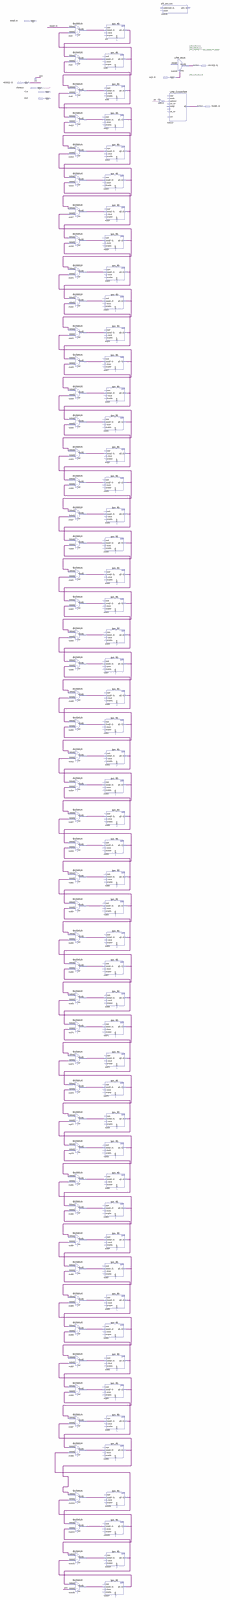
[diagram p0: schematic sheet, whole]
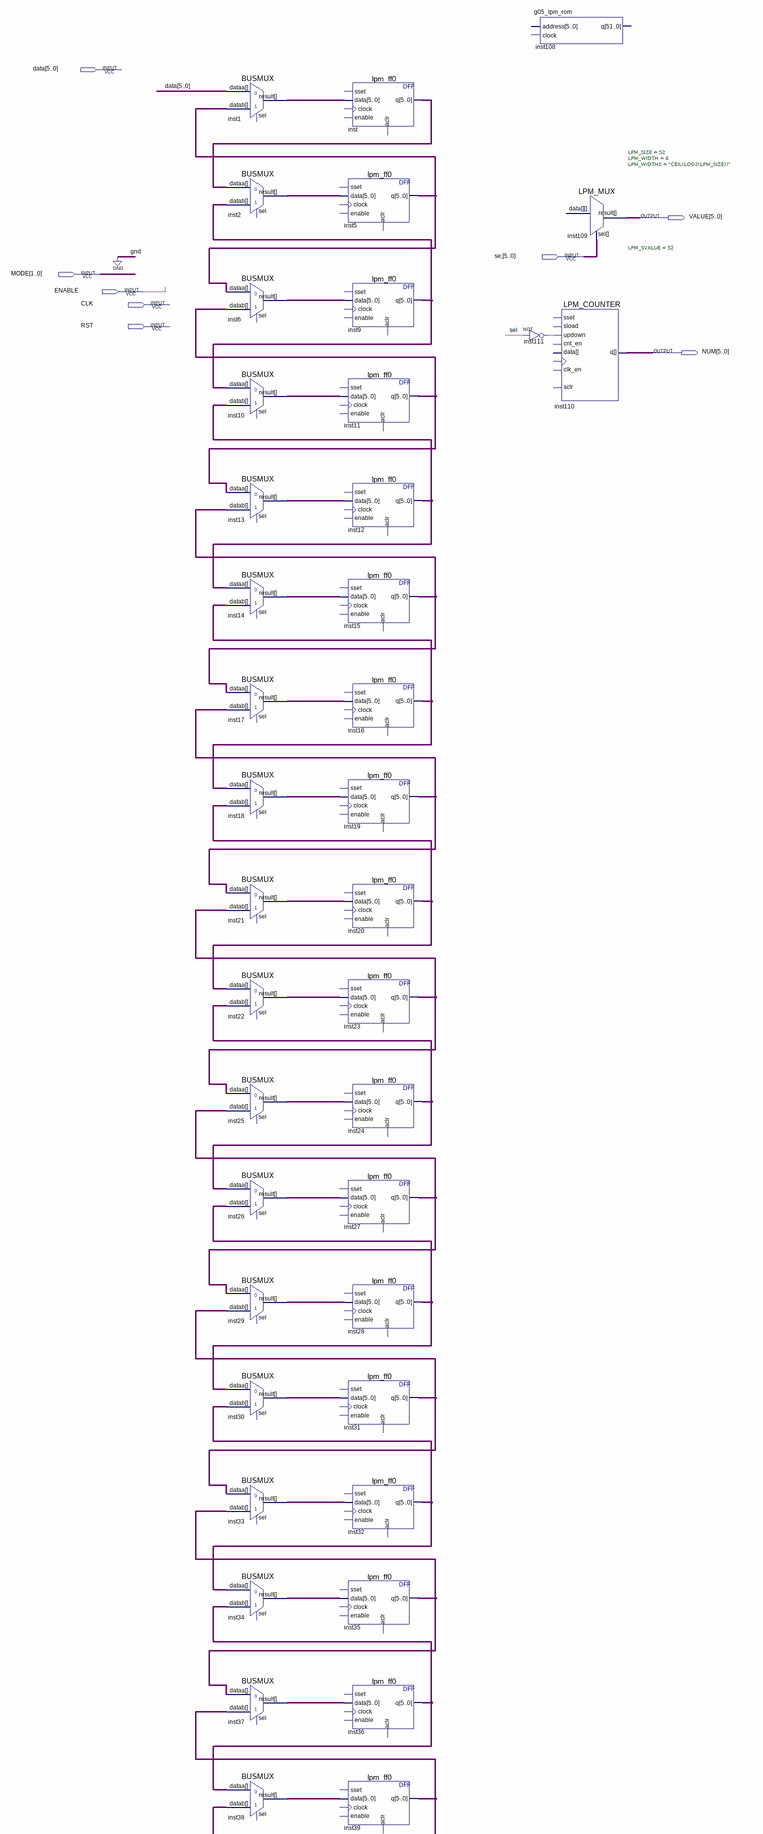
[diagram p1: schematic sheet, upper part]
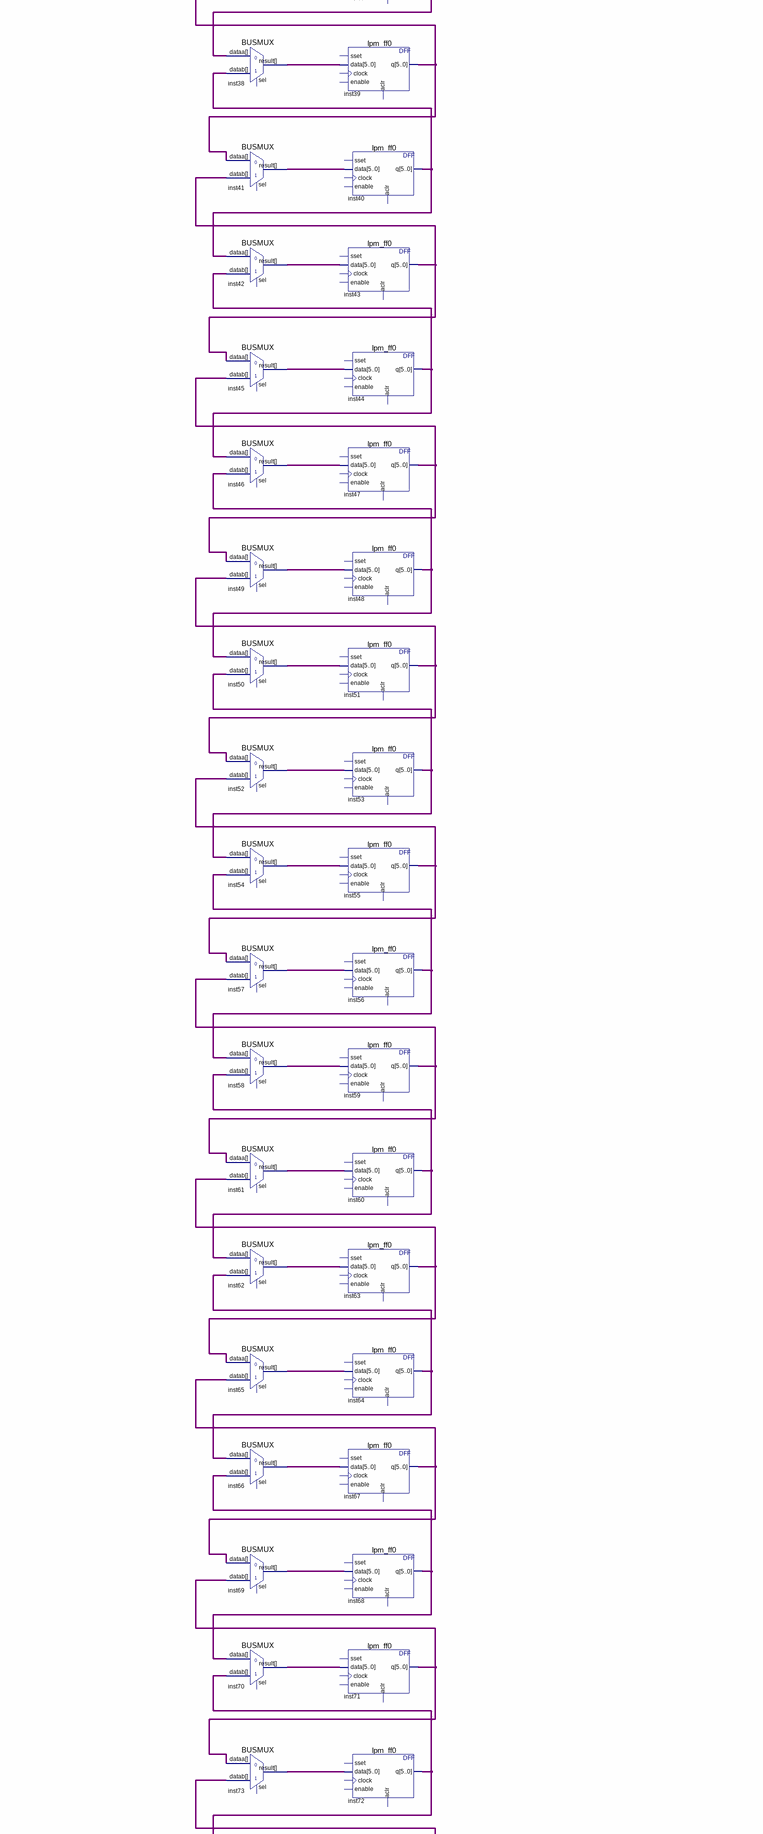
[diagram p2: schematic sheet, middle part]
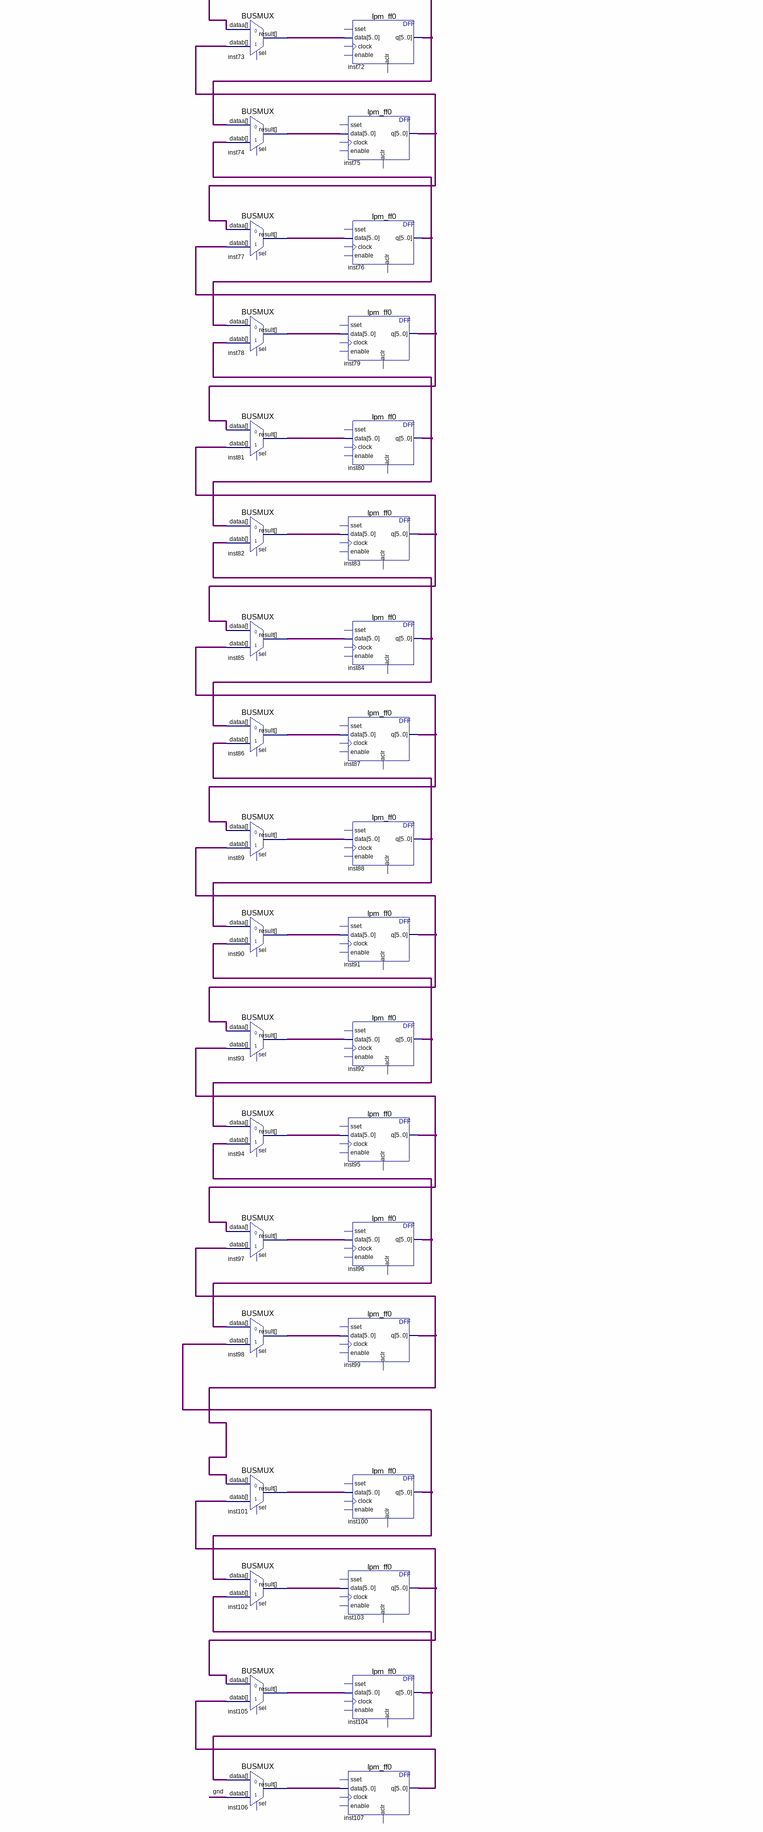
[diagram p3: schematic sheet, lower part]
// Quartus schematic a05_lab3.bdf as structural Verilog: 108 symbols, 8 pins
module a05_lab3 (
  input  [5:0] data,
  input  [5:0] \se; ,
  input  [1:0] MODE,
  input  ENABLE,
  input  CLK,
  input  RST,
  output [5:0] VALUE,
  output [5:0] NUM
);

  wire inst111_out, sel;
  wire [5:0] inst1_result, inst2_result, inst5_q, inst6_result, inst9_q, inst10_result, inst11_q, inst12_q,
       inst13_result, inst14_result, inst15_q, inst16_q, inst17_result, inst18_result, inst19_q, inst20_q,
       inst21_result, inst22_result, inst23_q, inst24_q, inst25_result, inst26_result, inst27_q, inst28_q,
       inst29_result, inst30_result, inst31_q, inst32_q, inst33_result, inst34_result, inst35_q, inst36_q,
       inst37_result, inst38_result, inst39_q, inst40_q, inst41_result, inst42_result, inst43_q, inst44_q,
       inst45_result, inst46_result, inst47_q, inst48_q, inst49_result, inst50_result, inst51_q,
       inst52_result, inst53_q, inst54_result, inst55_q, inst56_q, inst57_result, inst58_result, inst59_q,
       inst60_q, inst61_result, inst62_result, inst63_q, inst64_q, inst65_result, inst66_result, inst67_q,
       inst68_q, inst69_result, inst70_result, inst71_q, inst72_q, inst73_result, inst74_result, inst75_q,
       inst76_q, inst77_result, inst78_result, inst79_q, inst80_q, inst81_result, inst82_result, inst83_q,
       inst84_q, inst85_result, inst86_result, inst87_q, inst88_q, inst89_result, inst90_result, inst91_q,
       inst92_q, inst93_result, inst94_result, inst95_q, inst96_q, inst97_result, inst98_result, inst99_q,
       inst100_q, inst101_result, inst102_result, inst103_q, inst104_q, inst105_result, inst106_result,
       inst107_q, inst_q;

  BUSMUX inst1 (.datab(inst5_q), .dataa(data), .result(inst1_result));  // open: sel
  BUSMUX inst2 (.datab(inst9_q), .dataa(inst_q), .result(inst2_result));  // open: sel
  BUSMUX inst6 (.datab(inst11_q), .dataa(inst5_q), .result(inst6_result));  // open: sel
  BUSMUX inst10 (.datab(inst12_q), .dataa(inst9_q), .result(inst10_result));  // open: sel
  BUSMUX inst13 (.datab(inst15_q), .dataa(inst11_q), .result(inst13_result));  // open: sel
  BUSMUX inst14 (.datab(inst16_q), .dataa(inst12_q), .result(inst14_result));  // open: sel
  BUSMUX inst17 (.datab(inst19_q), .dataa(inst15_q), .result(inst17_result));  // open: sel
  BUSMUX inst18 (.datab(inst20_q), .dataa(inst16_q), .result(inst18_result));  // open: sel
  BUSMUX inst21 (.datab(inst23_q), .dataa(inst19_q), .result(inst21_result));  // open: sel
  BUSMUX inst22 (.datab(inst24_q), .dataa(inst20_q), .result(inst22_result));  // open: sel
  BUSMUX inst25 (.datab(inst27_q), .dataa(inst23_q), .result(inst25_result));  // open: sel
  BUSMUX inst26 (.datab(inst28_q), .dataa(inst24_q), .result(inst26_result));  // open: sel
  BUSMUX inst29 (.datab(inst31_q), .dataa(inst27_q), .result(inst29_result));  // open: sel
  BUSMUX inst30 (.datab(inst32_q), .dataa(inst28_q), .result(inst30_result));  // open: sel
  BUSMUX inst33 (.datab(inst35_q), .dataa(inst31_q), .result(inst33_result));  // open: sel
  BUSMUX inst34 (.datab(inst36_q), .dataa(inst32_q), .result(inst34_result));  // open: sel
  BUSMUX inst37 (.datab(inst39_q), .dataa(inst35_q), .result(inst37_result));  // open: sel
  BUSMUX inst38 (.datab(inst40_q), .dataa(inst36_q), .result(inst38_result));  // open: sel
  BUSMUX inst41 (.datab(inst43_q), .dataa(inst39_q), .result(inst41_result));  // open: sel
  BUSMUX inst42 (.datab(inst44_q), .dataa(inst40_q), .result(inst42_result));  // open: sel
  BUSMUX inst45 (.datab(inst47_q), .dataa(inst43_q), .result(inst45_result));  // open: sel
  BUSMUX inst46 (.datab(inst48_q), .dataa(inst44_q), .result(inst46_result));  // open: sel
  BUSMUX inst49 (.datab(inst51_q), .dataa(inst47_q), .result(inst49_result));  // open: sel
  BUSMUX inst50 (.datab(inst53_q), .dataa(inst48_q), .result(inst50_result));  // open: sel
  BUSMUX inst52 (.datab(inst55_q), .dataa(inst51_q), .result(inst52_result));  // open: sel
  BUSMUX inst54 (.datab(inst56_q), .dataa(inst53_q), .result(inst54_result));  // open: sel
  BUSMUX inst57 (.datab(inst59_q), .dataa(inst55_q), .result(inst57_result));  // open: sel
  BUSMUX inst58 (.datab(inst60_q), .dataa(inst56_q), .result(inst58_result));  // open: sel
  BUSMUX inst61 (.datab(inst63_q), .dataa(inst59_q), .result(inst61_result));  // open: sel
  BUSMUX inst62 (.datab(inst64_q), .dataa(inst60_q), .result(inst62_result));  // open: sel
  BUSMUX inst65 (.datab(inst67_q), .dataa(inst63_q), .result(inst65_result));  // open: sel
  BUSMUX inst66 (.datab(inst68_q), .dataa(inst64_q), .result(inst66_result));  // open: sel
  BUSMUX inst69 (.datab(inst71_q), .dataa(inst67_q), .result(inst69_result));  // open: sel
  BUSMUX inst70 (.datab(inst72_q), .dataa(inst68_q), .result(inst70_result));  // open: sel
  BUSMUX inst73 (.datab(inst75_q), .dataa(inst71_q), .result(inst73_result));  // open: sel
  BUSMUX inst74 (.datab(inst76_q), .dataa(inst72_q), .result(inst74_result));  // open: sel
  BUSMUX inst77 (.datab(inst79_q), .dataa(inst75_q), .result(inst77_result));  // open: sel
  BUSMUX inst78 (.datab(inst80_q), .dataa(inst76_q), .result(inst78_result));  // open: sel
  BUSMUX inst81 (.datab(inst83_q), .dataa(inst79_q), .result(inst81_result));  // open: sel
  BUSMUX inst82 (.datab(inst84_q), .dataa(inst80_q), .result(inst82_result));  // open: sel
  BUSMUX inst85 (.datab(inst87_q), .dataa(inst83_q), .result(inst85_result));  // open: sel
  BUSMUX inst86 (.datab(inst88_q), .dataa(inst84_q), .result(inst86_result));  // open: sel
  BUSMUX inst89 (.datab(inst91_q), .dataa(inst87_q), .result(inst89_result));  // open: sel
  BUSMUX inst90 (.datab(inst92_q), .dataa(inst88_q), .result(inst90_result));  // open: sel
  BUSMUX inst93 (.datab(inst95_q), .dataa(inst91_q), .result(inst93_result));  // open: sel
  BUSMUX inst94 (.datab(inst96_q), .dataa(inst92_q), .result(inst94_result));  // open: sel
  BUSMUX inst97 (.datab(inst99_q), .dataa(inst95_q), .result(inst97_result));  // open: sel
  BUSMUX inst98 (.datab(inst100_q), .dataa(inst96_q), .result(inst98_result));  // open: sel
  BUSMUX inst101 (.datab(inst103_q), .dataa(inst99_q), .result(inst101_result));  // open: sel
  BUSMUX inst102 (.datab(inst104_q), .dataa(inst100_q), .result(inst102_result));  // open: sel
  BUSMUX inst105 (.datab(inst107_q), .dataa(inst103_q), .result(inst105_result));  // open: sel
  BUSMUX inst106 (.datab(1'b0), .dataa(inst104_q), .result(inst106_result));  // open: sel
  lpm_ff0 inst (.data(inst1_result), .q(inst_q));  // open: sset, clock, enable, aclr
  lpm_ff0 inst5 (.data(inst2_result), .q(inst5_q));  // open: sset, clock, enable, aclr
  lpm_ff0 inst9 (.data(inst6_result), .q(inst9_q));  // open: sset, clock, enable, aclr
  lpm_ff0 inst11 (.data(inst10_result), .q(inst11_q));  // open: sset, clock, enable, aclr
  lpm_ff0 inst12 (.data(inst13_result), .q(inst12_q));  // open: sset, clock, enable, aclr
  lpm_ff0 inst15 (.data(inst14_result), .q(inst15_q));  // open: sset, clock, enable, aclr
  lpm_ff0 inst16 (.data(inst17_result), .q(inst16_q));  // open: sset, clock, enable, aclr
  lpm_ff0 inst19 (.data(inst18_result), .q(inst19_q));  // open: sset, clock, enable, aclr
  lpm_ff0 inst20 (.data(inst21_result), .q(inst20_q));  // open: sset, clock, enable, aclr
  lpm_ff0 inst23 (.data(inst22_result), .q(inst23_q));  // open: sset, clock, enable, aclr
  lpm_ff0 inst24 (.data(inst25_result), .q(inst24_q));  // open: sset, clock, enable, aclr
  lpm_ff0 inst27 (.data(inst26_result), .q(inst27_q));  // open: sset, clock, enable, aclr
  lpm_ff0 inst28 (.data(inst29_result), .q(inst28_q));  // open: sset, clock, enable, aclr
  lpm_ff0 inst31 (.data(inst30_result), .q(inst31_q));  // open: sset, clock, enable, aclr
  lpm_ff0 inst32 (.data(inst33_result), .q(inst32_q));  // open: sset, clock, enable, aclr
  lpm_ff0 inst35 (.data(inst34_result), .q(inst35_q));  // open: sset, clock, enable, aclr
  lpm_ff0 inst36 (.data(inst37_result), .q(inst36_q));  // open: sset, clock, enable, aclr
  lpm_ff0 inst39 (.data(inst38_result), .q(inst39_q));  // open: sset, clock, enable, aclr
  lpm_ff0 inst40 (.data(inst41_result), .q(inst40_q));  // open: sset, clock, enable, aclr
  lpm_ff0 inst43 (.data(inst42_result), .q(inst43_q));  // open: sset, clock, enable, aclr
  lpm_ff0 inst44 (.data(inst45_result), .q(inst44_q));  // open: sset, clock, enable, aclr
  lpm_ff0 inst47 (.data(inst46_result), .q(inst47_q));  // open: sset, clock, enable, aclr
  lpm_ff0 inst48 (.data(inst49_result), .q(inst48_q));  // open: sset, clock, enable, aclr
  lpm_ff0 inst51 (.data(inst50_result), .q(inst51_q));  // open: sset, clock, enable, aclr
  lpm_ff0 inst53 (.data(inst52_result), .q(inst53_q));  // open: sset, clock, enable, aclr
  lpm_ff0 inst55 (.data(inst54_result), .q(inst55_q));  // open: sset, clock, enable, aclr
  lpm_ff0 inst56 (.data(inst57_result), .q(inst56_q));  // open: sset, clock, enable, aclr
  lpm_ff0 inst59 (.data(inst58_result), .q(inst59_q));  // open: sset, clock, enable, aclr
  lpm_ff0 inst60 (.data(inst61_result), .q(inst60_q));  // open: sset, clock, enable, aclr
  lpm_ff0 inst63 (.data(inst62_result), .q(inst63_q));  // open: sset, clock, enable, aclr
  lpm_ff0 inst64 (.data(inst65_result), .q(inst64_q));  // open: sset, clock, enable, aclr
  lpm_ff0 inst67 (.data(inst66_result), .q(inst67_q));  // open: sset, clock, enable, aclr
  lpm_ff0 inst68 (.data(inst69_result), .q(inst68_q));  // open: sset, clock, enable, aclr
  lpm_ff0 inst71 (.data(inst70_result), .q(inst71_q));  // open: sset, clock, enable, aclr
  lpm_ff0 inst72 (.data(inst73_result), .q(inst72_q));  // open: sset, clock, enable, aclr
  lpm_ff0 inst75 (.data(inst74_result), .q(inst75_q));  // open: sset, clock, enable, aclr
  lpm_ff0 inst76 (.data(inst77_result), .q(inst76_q));  // open: sset, clock, enable, aclr
  lpm_ff0 inst79 (.data(inst78_result), .q(inst79_q));  // open: sset, clock, enable, aclr
  lpm_ff0 inst80 (.data(inst81_result), .q(inst80_q));  // open: sset, clock, enable, aclr
  lpm_ff0 inst83 (.data(inst82_result), .q(inst83_q));  // open: sset, clock, enable, aclr
  lpm_ff0 inst84 (.data(inst85_result), .q(inst84_q));  // open: sset, clock, enable, aclr
  lpm_ff0 inst87 (.data(inst86_result), .q(inst87_q));  // open: sset, clock, enable, aclr
  lpm_ff0 inst88 (.data(inst89_result), .q(inst88_q));  // open: sset, clock, enable, aclr
  lpm_ff0 inst91 (.data(inst90_result), .q(inst91_q));  // open: sset, clock, enable, aclr
  lpm_ff0 inst92 (.data(inst93_result), .q(inst92_q));  // open: sset, clock, enable, aclr
  lpm_ff0 inst95 (.data(inst94_result), .q(inst95_q));  // open: sset, clock, enable, aclr
  lpm_ff0 inst96 (.data(inst97_result), .q(inst96_q));  // open: sset, clock, enable, aclr
  lpm_ff0 inst99 (.data(inst98_result), .q(inst99_q));  // open: sset, clock, enable, aclr
  lpm_ff0 inst100 (.data(inst101_result), .q(inst100_q));  // open: sset, clock, enable, aclr
  lpm_ff0 inst103 (.data(inst102_result), .q(inst103_q));  // open: sset, clock, enable, aclr
  lpm_ff0 inst104 (.data(inst105_result), .q(inst104_q));  // open: sset, clock, enable, aclr
  lpm_ff0 inst107 (.data(inst106_result), .q(inst107_q));  // open: sset, clock, enable, aclr
  g05_lpm_rom inst108 ();  // open: address, clock, q
  not inst111 (inst111_out, sel);
  LPM_MUX #(.LPM_SIZE(52), .LPM_WIDTH(6), .LPM_WIDTHS("CEIL(LOG2(LPM_SIZE))")) inst109 (
    .sel(\se; ), .result(VALUE));  // open: data
  LPM_COUNTER #(.LPM_SVALUE(52)) inst110 (
    .updown(inst111_out), .q(NUM));  // open: sset, sload, cnt_en, data, clock, clk_en, sclr
endmodule
